# EAGLE design shield confortimetro 1.1 (EAGLE 7.2.0)
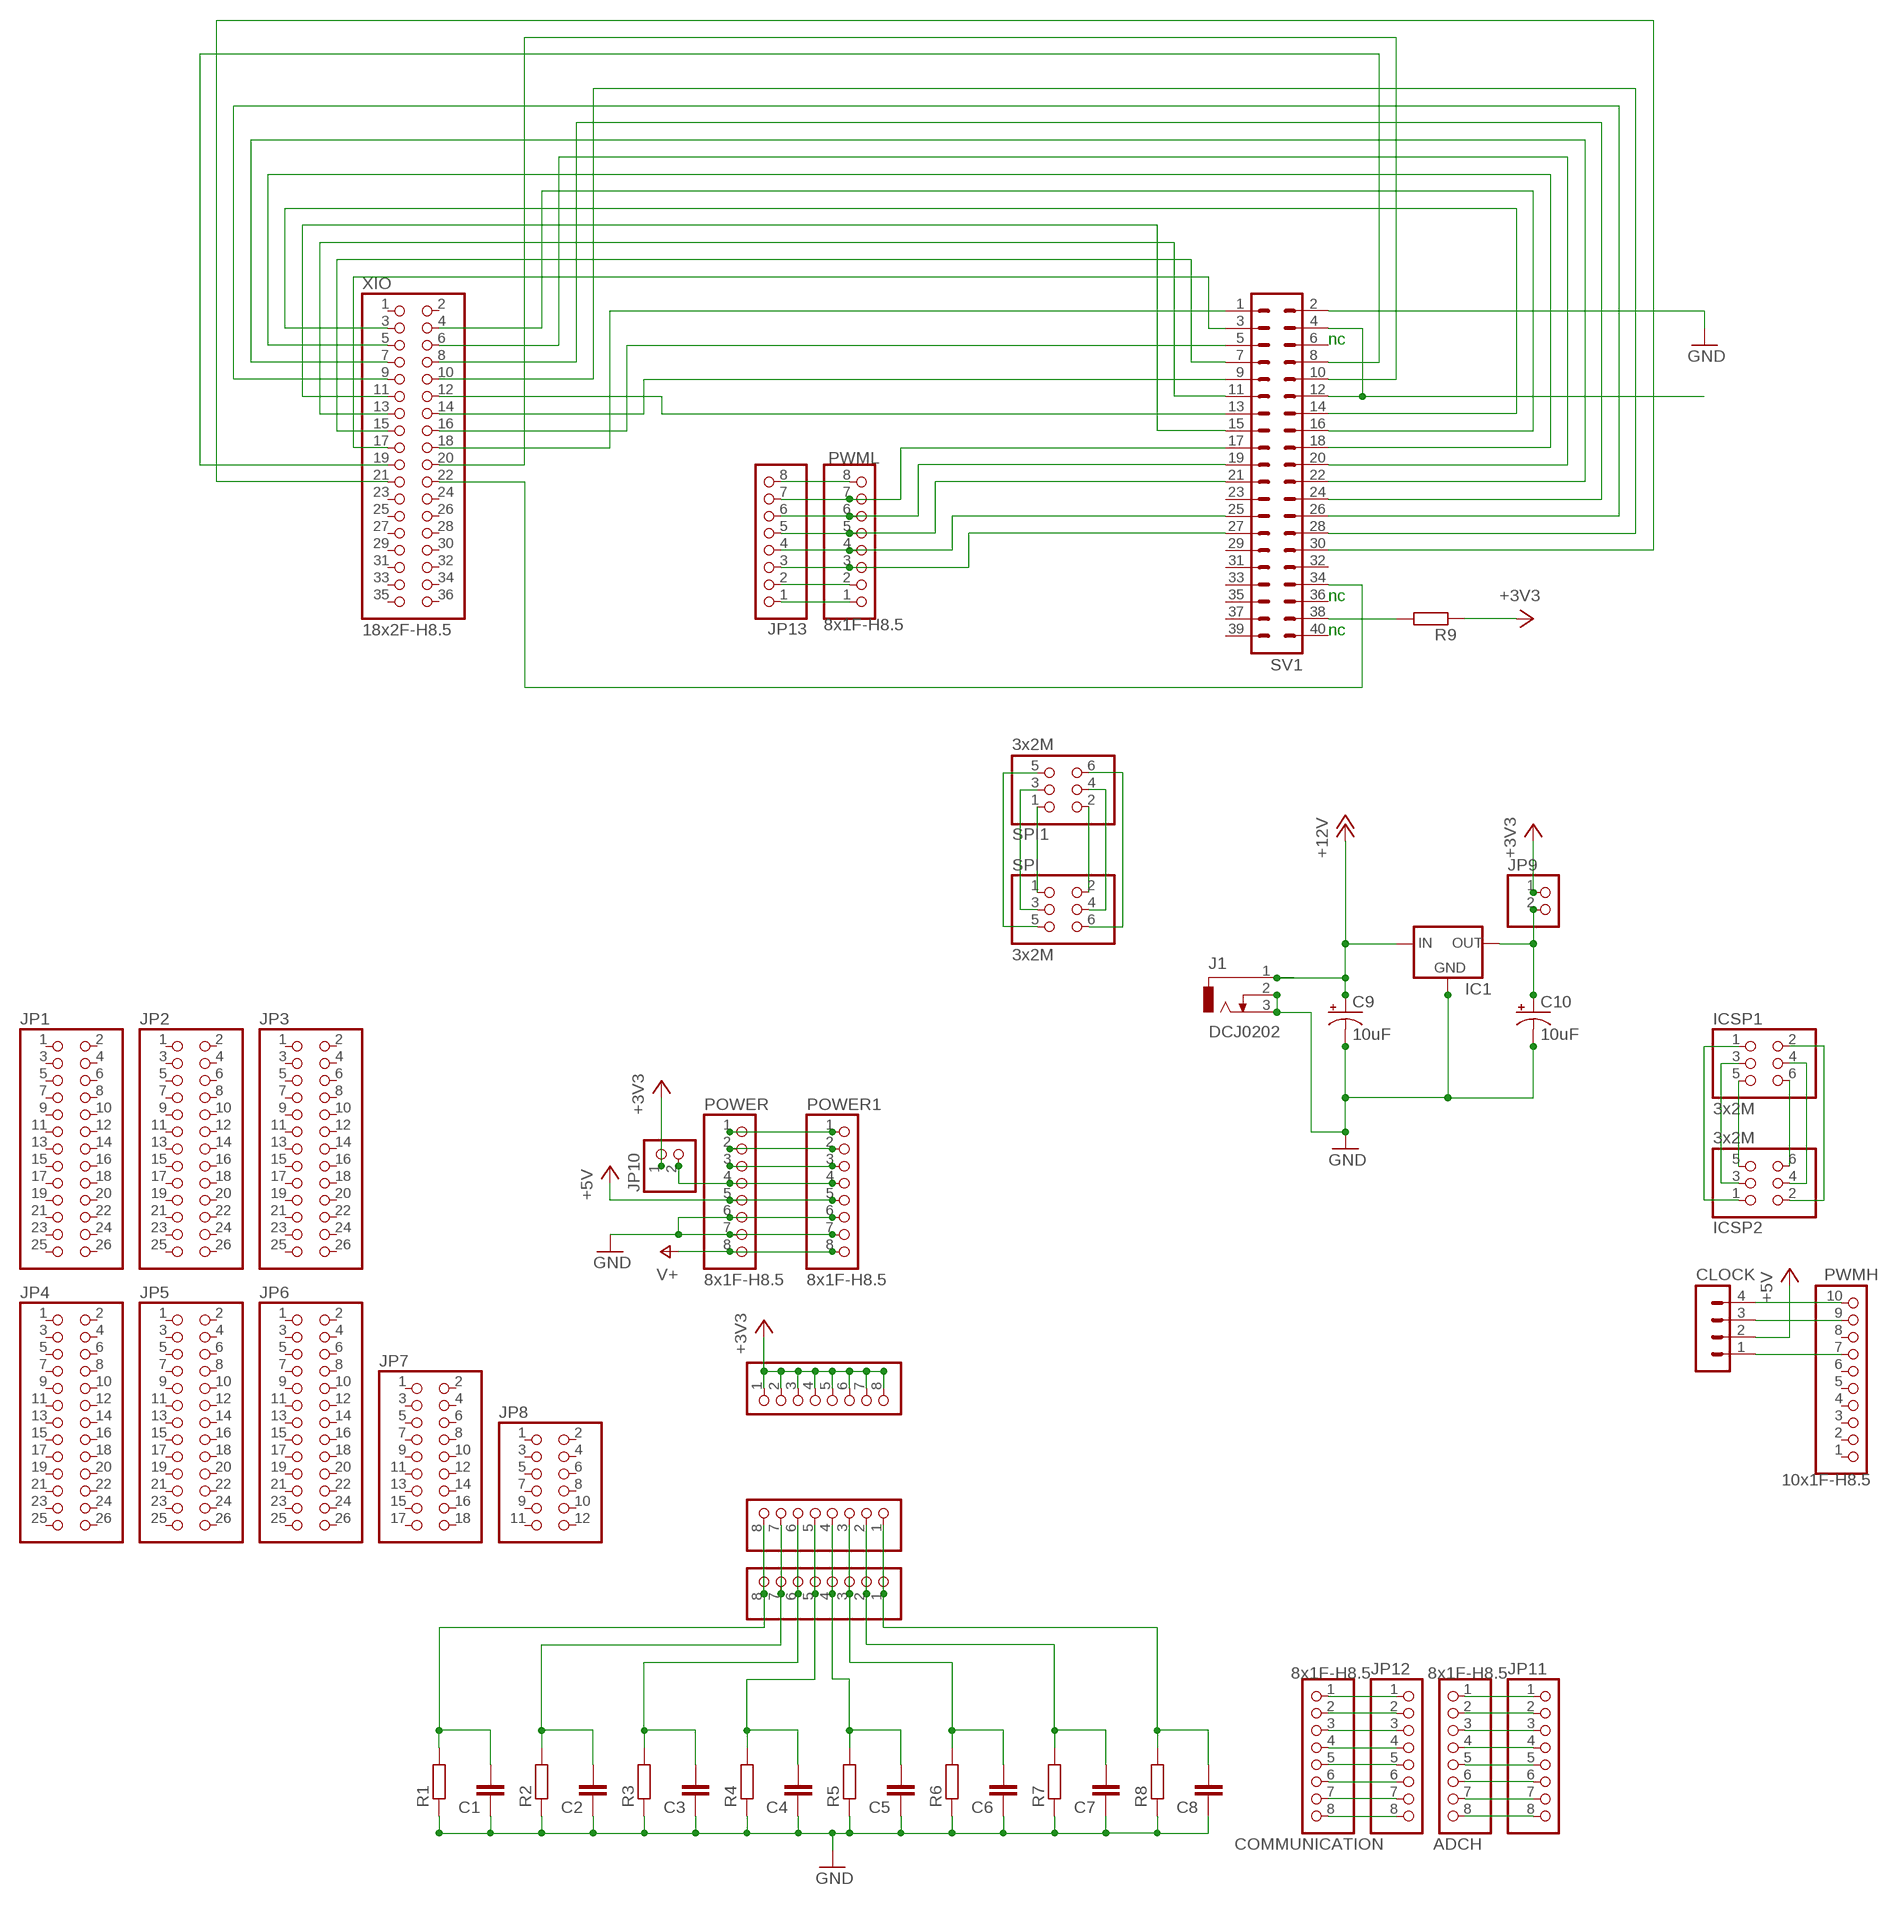
[diagram p0: schematic, sheet 1]

## Parts
ADCH  8x1F-H8.5  PINHD-1X8  [1X08]
ADCL  8x1F-H8.5  PINHD-1X8  [1X08]
C1  C5/2.5  [C5B2.5]
C2  C5/2.5  [C5B2.5]
C3  C5/2.5  [C5B2.5]
C4  C5/2.5  [C5B2.5]
C5  C5/2.5  [C5B2.5]
C6  C5/2.5  [C5B2.5]
C7  C5/2.5  [C5B2.5]
C8  C5/2.5  [C5B2.5]
C9  10uF  CPOL-USE2-5  [E2-5]
C10  10uF  CPOL-USE2-5  [E2-5]
CLOCK  MA04-1  [MA04-1]
COMMUNICATION  8x1F-H8.5  PINHD-1X8  [1X08]
IC1  78XXL  [78XXL]
ICSP1  3x2M  PINHD-2X3  [2X03]
ICSP2  3x2M  PINHD-2X3  [2X03]
J1  DCJ0202  [DCJ0202]
JP1  PINHD-2X13  [2X13]
JP2  PINHD-2X13  [2X13]
JP3  PINHD-2X13  [2X13]
JP4  PINHD-2X13  [2X13]
JP5  PINHD-2X13  [2X13]
JP6  PINHD-2X13  [2X13]
JP7  PINHD-2X9  [2X09]
JP8  PINHD-2X6  [2X06]
JP9  PINHD-1X2  [1X02]
JP10  PINHD-1X2  [1X02]
JP11  PINHD-1X8  [1X08]
JP12  PINHD-1X8  [1X08]
JP13  PINHD-1X8  [1X08]
POWER  8x1F-H8.5  PINHD-1X8  [1X08]
POWER1  8x1F-H8.5  PINHD-1X8  [1X08]
PWMH  10x1F-H8.5  PINHD-1X10  [1X10]
PWML  8x1F-H8.5  PINHD-1X8  [1X08]
PWML1  8x1F-H8.5  PINHD-1X8  [1X08]
PWML2  8x1F-H8.5  PINHD-1X8  [1X08]
R1  R-EU_0204/7  [0204/7]
R2  R-EU_0204/7  [0204/7]
R3  R-EU_0204/7  [0204/7]
R4  R-EU_0204/7  [0204/7]
R5  R-EU_0204/7  [0204/7]
R6  R-EU_0204/7  [0204/7]
R7  R-EU_0204/7  [0204/7]
R8  R-EU_0204/7  [0204/7]
R9  R-EU_0204/7  [0204/7]
SPI  3x2M  PINHD-2X3  [2X03]
SPI1  3x2M  PINHD-2X3  [2X03]
SV1  ML40  [ML40]
XIO  18x2F-H8.5  PINHD-2X18  [2X18]

## Nets
+3V3: JP9.1 JP10.1 PWML2.1 PWML2.2 PWML2.3 PWML2.4 PWML2.5 PWML2.6 PWML2.7 PWML2.8 R9.1
+5V: CLOCK.2 POWER1.5 POWER.5
+12V: C9.+ IC1.IN J1.1
GND: C1.1 C2.1 C3.1 C4.1 C5.1 C6.1 C7.1 C8.1 C9.- C10.- IC1.GND J1.2 J1.3 POWER1.6 POWER1.7 POWER.6 POWER.7 R1.1 R2.1 R3.1 R4.1 R5.1 R6.1 R7.1 R8.1 SV1.2
N$1: ADCL.2 C7.2 PWML1.2 R7.2
N$2: ADCL.8 C1.2 PWML1.8 R1.2
N$3: ADCL.7 C2.2 PWML1.7 R2.2
N$4: ADCL.6 C3.2 PWML1.6 R3.2
N$5: ADCL.5 C4.2 PWML1.5 R4.2
N$6: ADCL.4 C5.2 PWML1.4 R5.2
N$7: POWER1.1 POWER.1
N$8: POWER1.2 POWER.2
N$9: POWER1.3 POWER.3
N$10: ADCL.3 C6.2 PWML1.3 R6.2
N$11: ADCL.1 C8.2 PWML1.1 R8.2
N$12: ICSP1.5 ICSP2.5
N$13: ICSP1.6 ICSP2.6
N$14: ICSP1.3 ICSP2.3
N$15: ICSP1.1 ICSP2.1
N$16: ICSP1.4 ICSP2.4
N$17: ICSP1.2 ICSP2.2
N$18: SPI1.1 SPI.1
N$19: SPI1.2 SPI.2
N$20: SPI1.3 SPI.3
N$21: SPI1.4 SPI.4
N$22: SPI1.6 SPI.6
N$23: SPI1.5 SPI.5
N$24: SV1.1 XIO.18
N$25: CLOCK.4 PWMH.10
N$26: CLOCK.3 PWMH.9
N$27: CLOCK.1 PWMH.7
N$29: ADCH.1 JP11.1
N$30: ADCH.8 JP11.8
N$31: ADCH.7 JP11.7
N$32: ADCH.6 JP11.6
N$33: ADCH.5 JP11.5
N$34: ADCH.4 JP11.4
N$35: ADCH.3 JP11.3
N$36: ADCH.2 JP11.2
N$37: COMMUNICATION.8 JP12.8
N$38: COMMUNICATION.7 JP12.7
N$39: COMMUNICATION.6 JP12.6
N$40: COMMUNICATION.5 JP12.5
N$41: COMMUNICATION.4 JP12.4
N$42: COMMUNICATION.3 JP12.3
N$43: COMMUNICATION.2 JP12.2
N$44: COMMUNICATION.1 JP12.1
N$45: JP13.8 PWML.8
N$46: JP13.7 PWML.7 SV1.17
N$47: JP13.6 PWML.6 SV1.19
N$48: JP13.5 PWML.5 SV1.21
N$49: JP13.4 PWML.4 SV1.25
N$50: JP13.3 PWML.3 SV1.27
N$51: JP13.2 PWML.2
N$52: JP13.1 PWML.1
N$53: SV1.3 XIO.17
N$54: SV1.5 XIO.16
N$55: SV1.7 XIO.15
N$56: SV1.9 XIO.14
N$57: SV1.11 XIO.13
N$58: SV1.13 XIO.12
N$59: SV1.15 XIO.11
N$60: SV1.14 XIO.3
N$61: SV1.16 XIO.4
N$62: SV1.18 XIO.5
N$63: SV1.20 XIO.6
N$64: SV1.22 XIO.7
N$65: SV1.24 XIO.8
N$66: SV1.26 XIO.9
N$67: SV1.28 XIO.10
N$68: SV1.30 XIO.21
N$69: SV1.4 SV1.12
N$70: SV1.10 XIO.20
N$71: SV1.8 XIO.19
N$72: SV1.34 XIO.22
N$73: R9.2 SV1.38
N$74: C10.+ IC1.OUT JP9.2
N$75: JP10.2 POWER1.4 POWER.4
V+: POWER1.8 POWER.8
Unconnected: JP1.1 JP1.2 JP1.3 JP1.4 JP1.5 JP1.6 JP1.7 JP1.8 JP1.9 JP1.10 JP1.11 JP1.12 JP1.13 JP1.14 JP1.15 JP1.16 JP1.17 JP1.18 JP1.19 JP1.20 JP1.21 JP1.22 JP1.23 JP1.24 JP1.25 JP1.26 JP2.1 JP2.2 JP2.3 JP2.4 JP2.5 JP2.6 JP2.7 JP2.8 JP2.9 JP2.10 JP2.11 JP2.12 JP2.13 JP2.14 JP2.15 JP2.16 JP2.17 JP2.18 JP2.19 JP2.20 JP2.21 JP2.22 JP2.23 JP2.24 JP2.25 JP2.26 JP3.1 JP3.2 JP3.3 JP3.4 JP3.5 JP3.6 JP3.7 JP3.8 JP3.9 JP3.10 JP3.11 JP3.12 JP3.13 JP3.14 JP3.15 JP3.16 JP3.17 JP3.18 JP3.19 JP3.20 JP3.21 JP3.22 JP3.23 JP3.24 JP3.25 JP3.26 JP4.1 JP4.2 JP4.3 JP4.4 JP4.5 JP4.6 JP4.7 JP4.8 JP4.9 JP4.10 JP4.11 JP4.12 JP4.13 JP4.14 JP4.15 JP4.16 JP4.17 JP4.18 JP4.19 JP4.20 JP4.21 JP4.22 JP4.23 JP4.24 JP4.25 JP4.26 JP5.1 JP5.2 JP5.3 JP5.4 JP5.5 JP5.6 JP5.7 JP5.8 JP5.9 JP5.10 JP5.11 JP5.12 JP5.13 JP5.14 JP5.15 JP5.16 JP5.17 JP5.18 JP5.19 JP5.20 JP5.21 JP5.22 JP5.23 JP5.24 JP5.25 JP5.26 JP6.1 JP6.2 JP6.3 JP6.4 JP6.5 JP6.6 JP6.7 JP6.8 JP6.9 JP6.10 JP6.11 JP6.12 JP6.13 JP6.14 JP6.15 JP6.16 JP6.17 JP6.18 JP6.19 JP6.20 JP6.21 JP6.22 JP6.23 JP6.24 JP6.25 JP6.26 JP7.1 JP7.2 JP7.3 JP7.4 JP7.5 JP7.6 JP7.7 JP7.8 JP7.9 JP7.10 JP7.11 JP7.12 JP7.13 JP7.14 JP7.15 JP7.16 JP7.17 JP7.18 JP8.1 JP8.2 JP8.3 JP8.4 JP8.5 JP8.6 JP8.7 JP8.8 JP8.9 JP8.10 JP8.11 JP8.12 PWMH.1 PWMH.2 PWMH.3 PWMH.4 PWMH.5 PWMH.6 PWMH.8 SV1.6 SV1.23 SV1.29 SV1.31 SV1.32 SV1.33 SV1.35 SV1.36 SV1.37 SV1.39 SV1.40 XIO.1 XIO.2 XIO.23 XIO.24 XIO.25 XIO.26 XIO.27 XIO.28 XIO.29 XIO.30 XIO.31 XIO.32 XIO.33 XIO.34 XIO.35 XIO.36

## Notes on the sheet
- nc
- nc
- nc

## Library data of the parts
ADCH ADCL COMMUNICATION POWER POWER1 PWML PWML1 PWML2 = SmartPrj:PINHD-1X8: PIN HEADER
C1-C8 = capacitor-wima:C: CAPACITOR naming: grid - package width
C9 C10 = rcl:CPOL-US: POLARIZED CAPACITOR, American symbol
CLOCK = con-lstb:MA04-1: PIN HEADER; OC_FARNELL: unknown; OC_NEWARK: unknown
IC1 = v-reg:78XXL: VOLTAGE REGULATOR
ICSP1 ICSP2 SPI SPI1 = SmartPrj:PINHD-2X3: PIN HEADER
J1 = con-jack:DCJ0202: DC POWER JACK Source: DCJ0202.pdf; OC_FARNELL: unknown; OC_NEWARK: unknown
JP1-JP6 = pinhead:PINHD-2X13: PIN HEADER
JP7 = pinhead:PINHD-2X9: PIN HEADER
JP8 = pinhead:PINHD-2X6: PIN HEADER
JP9 JP10 = pinhead:PINHD-1X2: PIN HEADER
JP11-JP13 = pinhead:PINHD-1X8: PIN HEADER
PWMH = SmartPrj:PINHD-1X10: PIN HEADER
R1-R9 = rcl:R-EU_: RESISTOR, European symbol
SV1 = con-harting-ml:ML40: HARTING; OC_FARNELL: unknown; OC_NEWARK: unknown
XIO = SmartPrj:PINHD-2X18: PIN HEADER

## Net classes
0 default: width 0.203 mm, drill 0.406 mm, clearance 0.203 mm
1 USB: width 0.203 mm, drill 0.406 mm, clearance 0.203 mm
2 gnd: width 0.203 mm, drill 0.406 mm, clearance 0.203 mm
3 usbvcc: width 0.203 mm, drill 0.406 mm, clearance 0.203 mm
4 USBpair: width 0.254 mm, drill 0.406 mm, clearance 0.61 mm

## Board
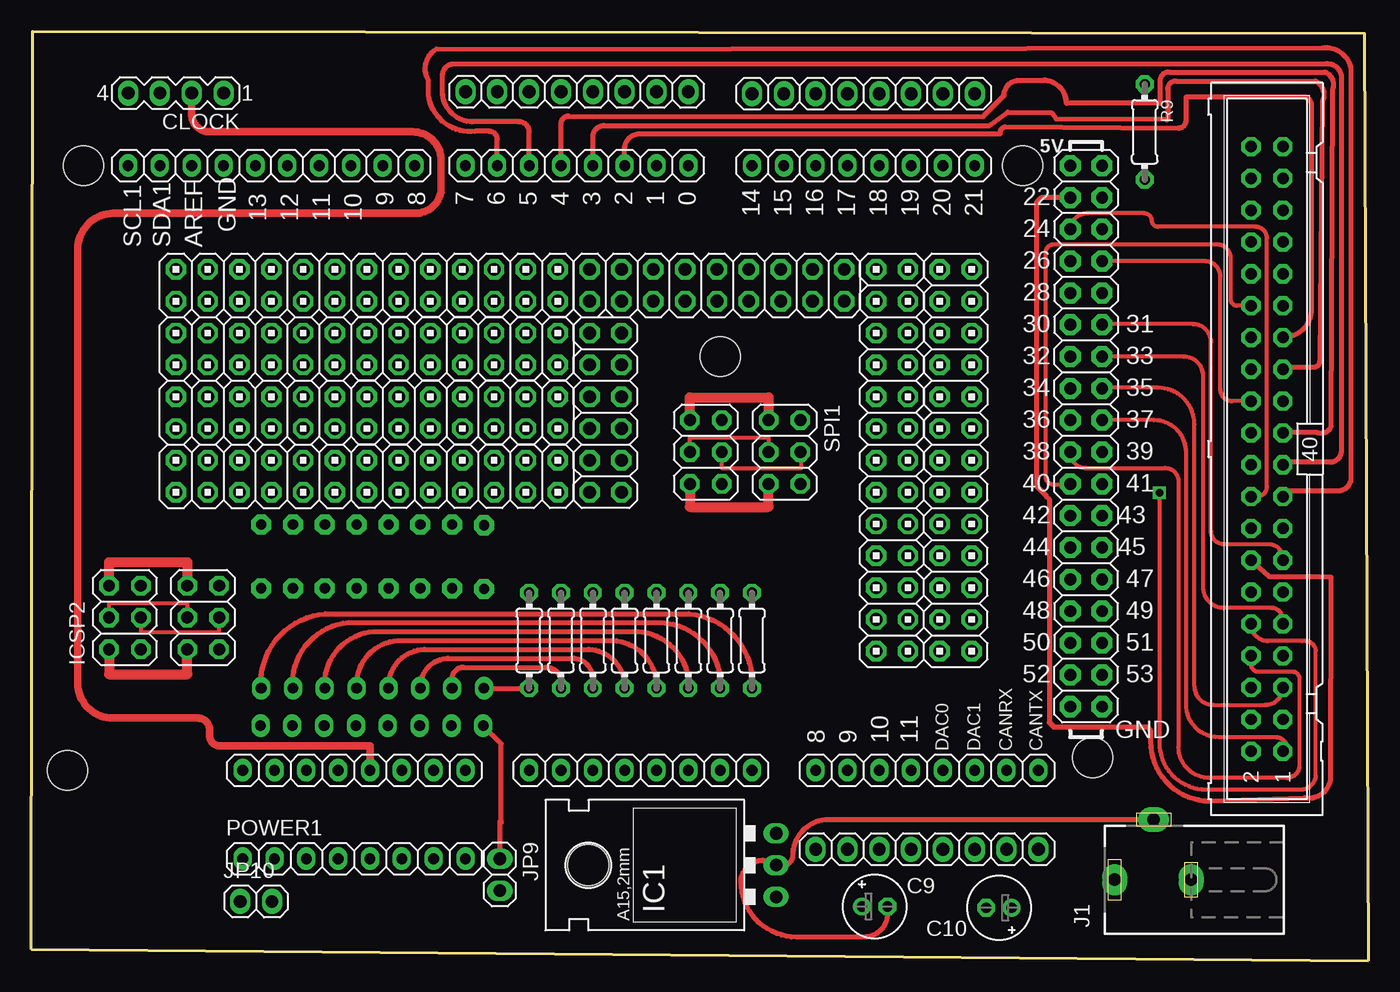
[diagram p1: board, top side]
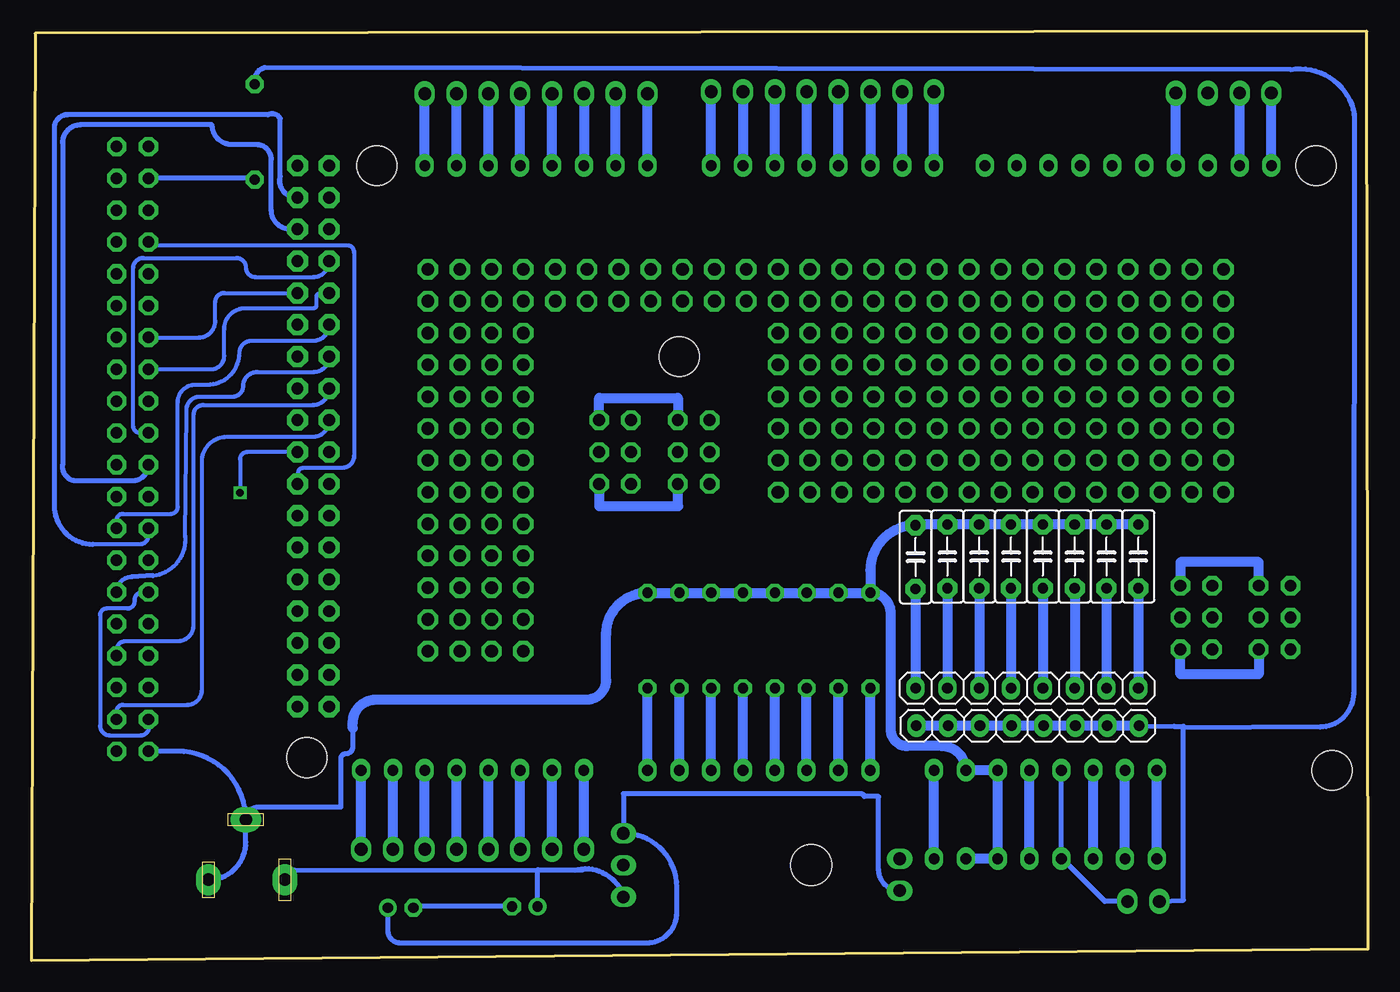
[diagram p2: board, bottom side, seen from below]

Size 106.68 x 74.17 mm. Coordinates in mm from the lower left corner, seen from the top.
Outline: 0,0.91 106.68,0 106.38,74.02 0.1,74.17 0,0.91
Copper layers (1*16): Top 0.035mm / dielectric 1.6mm / Bottom 0.035mm
Design rules "default *": minimum track width 8mil, minimum drill 16mil, track to track 8mil, track to pad 8mil, pad to pad 8mil, via to via 8mil, smd to smd 6mil, copper to edge 20mil, drill to drill 12mil, minimum pad ring 12mil, minimum via ring 8mil, stop-mask expansion 2mil, vias tented up to drill 25mil, thermal gap 8mil
Holes 3.2 mm at 84.68,16.21 4.17,63.45 79.1,63.45 2.9,15.19 54.97,48.21
tRestrict: area 1.6,60.9 to 6.7,66; area 52.4,45.7 to 57.5,50.7; area 76.6,60.9 to 81.6,66; area 82.9,12.6 to 88,17.7; area 0.4,12.6 to 5.4,17.7; 5 lines
bRestrict: area 1.6,60.9 to 6.7,66; area 52.4,45.7 to 57.5,50.7; area 76.6,60.9 to 81.6,66; area 82.9,12.6 to 88,17.7; area 0.4,12.6 to 5.4,17.7; 5 lines

### Footprints (pad centres in the part's own frame; a part is rotated, then mirrored left to right if it is on the bottom)
1X08 = drill 0.85 pad 1.422 long: 1 -8.89,0; 2 -6.35,0; 3 -3.81,0; 4 -1.27,0; 5 1.27,0; 6 3.81,0; 7 6.35,0; 8 8.89,0
C5B2.5 = drill 0.813 pad 1.6 octagon: 1 -2.54,0; 2 2.54,0
E2-5 = drill 0.813 pad 1.27: + -1.016,0 | drill 0.813 pad 1.27 octagon: - 1.016,0
MA04-1 = drill 1.016 long: 1 -3.81,0; 2 -1.27,0; 3 1.27,0; 4 3.81,0
78XXL = drill 1.016 long: GND 0,-3.81; IN -2.54,-3.81; OUT 2.54,-3.81 | hole 3.302: 0,11.176
2X03 = drill 0.95 pad 1.55 octagon: 1 -2.54,-1.27; 2 -2.54,1.27; 3 0,-1.27; 4 0,1.27; 5 2.54,-1.27; 6 2.54,1.27
DCJ0202 = drill 1 pad 2 long: 1 0,3.1; 2 4.8,0; 3 0,-3
2X13 = drill 1.016 octagon: 1 -15.24,-1.27; 2 -15.24,1.27; 3 -12.7,-1.27; 4 -12.7,1.27; 5 -10.16,-1.27; 6 -10.16,1.27; 7 -7.62,-1.27; 8 -7.62,1.27; 9 -5.08,-1.27; 10 -5.08,1.27; 11 -2.54,-1.27; 12 -2.54,1.27; 13 0,-1.27; 14 0,1.27; 15 2.54,-1.27; 16 2.54,1.27; 17 5.08,-1.27; 18 5.08,1.27; 19 7.62,-1.27; 20 7.62,1.27; 21 10.16,-1.27; 22 10.16,1.27; 23 12.7,-1.27; 24 12.7,1.27; 25 15.24,-1.27; 26 15.24,1.27
2X09 = drill 1.016 octagon: 1 -10.16,-1.27; 2 -10.16,1.27; 3 -7.62,-1.27; 4 -7.62,1.27; 5 -5.08,-1.27; 6 -5.08,1.27; 7 -2.54,-1.27; 8 -2.54,1.27; 9 0,-1.27; 10 0,1.27; 11 2.54,-1.27; 12 2.54,1.27; 13 5.08,-1.27; 14 5.08,1.27; 15 7.62,-1.27; 16 7.62,1.27; 17 10.16,-1.27; 18 10.16,1.27
2X06 = drill 1.016 octagon: 1 -6.35,-1.27; 2 -6.35,1.27; 3 -3.81,-1.27; 4 -3.81,1.27; 5 -1.27,-1.27; 6 -1.27,1.27; 7 1.27,-1.27; 8 1.27,1.27; 9 3.81,-1.27; 10 3.81,1.27; 11 6.35,-1.27; 12 6.35,1.27
1X02 = drill 1.016 long: 1 -1.27,0; 2 1.27,0
1X08' = drill 1.016 long: 1 -8.89,0; 2 -6.35,0; 3 -3.81,0; 4 -1.27,0; 5 1.27,0; 6 3.81,0; 7 6.35,0; 8 8.89,0
1X10 = drill 0.85 pad 1.422 long: 1 -11.43,0; 2 -8.89,0; 3 -6.35,0; 4 -3.81,0; 5 -1.27,0; 6 1.27,0; 7 3.81,0; 8 6.35,0; 9 8.89,0; 10 11.43,0
0204/7 = drill 0.813 octagon: 1 -3.81,0; 2 3.81,0
ML40 = drill 0.914 octagon: 1 -24.13,-1.27; 2 -24.13,1.27; 3 -21.59,-1.27; 4 -21.59,1.27; 5 -19.05,-1.27; 6 -19.05,1.27; 7 -16.51,-1.27; 8 -16.51,1.27; 9 -13.97,-1.27; 10 -13.97,1.27; 11 -11.43,-1.27; 12 -11.43,1.27; 13 -8.89,-1.27; 14 -8.89,1.27; 15 -6.35,-1.27; 16 -6.35,1.27; 17 -3.81,-1.27; 18 -3.81,1.27; 19 -1.27,-1.27; 20 -1.27,1.27; 21 1.27,-1.27; 22 1.27,1.27; 23 3.81,-1.27; 24 3.81,1.27; 25 6.35,-1.27; 26 6.35,1.27; 27 8.89,-1.27; 28 8.89,1.27; 29 11.43,-1.27; 30 11.43,1.27; 31 13.97,-1.27; 32 13.97,1.27; 33 16.51,-1.27; 34 16.51,1.27; 35 19.05,-1.27; 36 19.05,1.27; 37 21.59,-1.27; 38 21.59,1.27; 39 24.13,-1.27; 40 24.13,1.27
2X18 = drill 0.95 pad 1.676 octagon: 1 -21.59,-1.27; 2 -21.59,1.27; 3 -19.05,-1.27; 4 -19.05,1.27; 5 -16.51,-1.27; 6 -16.51,1.27; 7 -13.97,-1.27; 8 -13.97,1.27; 9 -11.43,-1.27; 10 -11.43,1.27; 11 -8.89,-1.27; 12 -8.89,1.27; 13 -6.35,-1.27; 14 -6.35,1.27; 15 -3.81,-1.27; 16 -3.81,1.27; 17 -1.27,-1.27; 18 -1.27,1.27; 19 1.27,-1.27; 20 1.27,1.27; 21 3.81,-1.27; 22 3.81,1.27; 23 6.35,-1.27; 24 6.35,1.27; 25 8.89,-1.27; 26 8.89,1.27; 27 11.43,-1.27; 28 11.43,1.27; 29 13.97,-1.27; 30 13.97,1.27; 31 16.51,-1.27; 32 16.51,1.27; 33 19.05,-1.27; 34 19.05,1.27; 35 21.59,-1.27; 36 21.59,1.27

### Placement (x,y rotation side)
ADCH  71.48,15.19 0 top
ADCL  48.62,15.19 0 top
C1  18.34,32.26 270 bottom
C2  20.88,32.26 270 bottom
C3  23.42,32.26 270 bottom
C4  25.96,32.26 270 bottom
C5  28.5,32.26 270 bottom
C6  31.04,32.26 270 bottom
C7  33.58,32.26 270 bottom
C8  36.12,32.21 270 bottom
C9  67.31,4.32 0 top
C10  77.22,4.22 180 top
CLOCK  11.53,69.24 180 top
COMMUNICATION  66.4,63.45 0 top
IC1  55.63,7.62 90 top
ICSP1  13.71,27.38 90 top
ICSP2  7.47,27.38 90 top
J1  89.56,6.45 90 top
JP1  26.77,53.9 0 top
JP2  26.77,48.82 0 top
JP3  26.77,43.74 0 top
JP4  26.77,38.66 0 top
JP5  68.68,39.93 90 top
JP6  73.76,39.93 90 top
JP7  54.71,53.9 0 top
JP8  45.82,43.74 90 top
JP9  37.39,6.86 270 top
JP10  17.93,4.72 0 top
JP11  [1X08']  71.48,8.89 0 top
JP12  [1X08']  66.4,69.19 0 top
JP13  [1X08']  43.54,69.34 180 top
POWER  25.76,15.19 0 top
POWER1  25.76,8.13 0 top
PWMH  19.15,63.45 180 top
PWML  43.54,63.45 180 top
PWML1  27.23,21.74 0 bottom
PWML2  27.18,18.75 0 bottom
R1  57.51,25.55 270 top
R2  54.97,25.55 270 top
R3  52.43,25.55 270 top
R4  49.89,25.55 270 top
R5  47.35,25.55 270 top
R6  44.81,25.55 270 top
R7  42.27,25.55 270 top
R8  39.73,25.55 270 top
R9  88.85,66.14 270 top
SPI  53.82,40.59 270 top
SPI1  60.1,40.59 270 top
SV1  98.6,40.84 90 top
XIO  84.18,41.86 270 top

### Tracks (layer width: path | path; a pad name or v marks a point on that pad's centre or on a via)
+3V3
  Top 0.406: PWML2.1 37.49,17.32 37.49,11.13 | 37.49,11.02 37.49,11.13 | JP9.1 37.39,11.02 arc-90 37.49,11.13
  Bottom 0.406: PWML2.8 15.49,18.69 14.73,18.69 14.73,18.59 | JP10.1 14.73,4.83 14.73,18.59 | 14.73,18.59 3.86,18.64 arc-90 1.17,21.34 1.12,67.51 arc-90 6.2,71.12 88.04,71.27 arc-90 R9.1
  Bottom 0.813: PWML2.8 PWML2.7 PWML2.6 PWML2.5 PWML2.4 PWML2.3 PWML2.2 PWML2.1
+5V
  Top 0.61: CLOCK.2 12.8,67.56 arc90 14.22,66.14 30.43,66.14 arc-90 32.72,63.86 32.72,61.72 arc-90 30.63,59.64 6.55,59.64 arc90 3.71,56.79 3.71,22.15 arc90 6.5,19.36 13.31,19.36 arc-90 14.22,18.44 14.22,17.98 arc90 15.09,17.12 27.03,17.12 POWER.5
  Bottom 0.813: POWER1.5 POWER.5
+12V
  Bottom 0.406: J1.1 arc90 85.7,7.21 66.24,7.26 | 66.24,7.26 62.64,7.26 63.35,7.21 arc90 IC1.IN 59.54,5.08 | C9.+ 66.29,7.21 arc90 66.24,7.26
GND
  Top 0.406: J1.2 63.63,11.25 arc90 60.76,8.38 arc-90 59.99,7.62 IC1.GND arc129 56.64,6.3 arc90 61.06,1.88 66.45,1.88 arc90 68.33,3.76 C9.-
  Bottom 0.406: 97.38,16.66 arc90 SV1.2 95.02,16.71 arc90 J1.2 | J1.3 arc-90 89.56,9.45 J1.2 | C9.- 76.1,4.32 arc-90 C10.- | 81.03,18.54 81.03,17.07 arc90 81.58,16.51 arc-90 81.99,16.1 81.99,12.24 88.57,12.24 arc-90 J1.2
  Bottom 0.813: R8.1 R7.1 R6.1 R5.1 R4.1 R3.1 R2.1 R1.1 arc-90 60.81,26.06 60.81,22.4 arc90 62.38,20.83 79.2,20.83 arc-90 81.03,19 81.03,18.54 | C1.1 C2.1 C3.1 C4.1 C5.1 C6.1 C7.1 36.07,34.8 arc-90 C8.1 arc-90 39.73,31.14 R8.1 | R8.1 arc90 38.1,27.74 38.1,18.44 arc-90 36.78,17.12 34.04,17.12 arc90 POWER.7 POWER.6 POWER1.6 POWER1.7
N$1
  Top 0.406: PWML1.2 33.58,22.5 arc-90 34.49,23.42 41.05,23.42 arc-90 42.27,22.3 R7.2
  Bottom 0.813: ADCL.2 R7.2 | C7.2 PWML1.2
N$2
  Top 0.406: PWML1.8 arc-90 23.47,27.69 52.48,27.69 arc-90 R1.2
  Bottom 0.813: ADCL.8 R1.2 | C1.2 PWML1.8
N$3
  Top 0.406: PWML1.7 arc-90 25.3,26.98 50.34,26.98 arc-90 R2.2
  Bottom 0.813: ADCL.7 R2.2 | C2.2 PWML1.7
N$4
  Top 0.406: PWML1.6 arc-90 27.33,26.26 48.41,26.26 arc-90 R3.2
  Bottom 0.813: ADCL.6 R3.2 | C3.2 PWML1.6
N$5
  Top 0.406: PWML1.5 arc-90 29.26,25.55 46.38,25.55 arc-90 R4.2
  Bottom 0.813: ADCL.5 R4.2 | C4.2 PWML1.5
N$6
  Top 0.406: PWML1.4 arc-90 31.34,24.84 44.5,24.84 arc-90 R5.2
  Bottom 0.813: ADCL.4 R5.2 | C5.2 PWML1.4
N$7
  Bottom 0.813: POWER1.1 POWER.1
N$8
  Bottom 0.813: POWER1.2 POWER.2
N$9
  Bottom 0.813: POWER1.3 POWER.3
N$10
  Top 0.406: PWML1.3 arc-90 33.22,24.13 43.18,24.13 arc-90 44.81,22.5 R6.2
  Bottom 0.813: ADCL.3 R6.2 | C6.2 PWML1.3
N$11
  Top 0.406: PWML1.1 R8.2
  Bottom 0.813: ADCL.1 R8.2 | C8.2 PWML1.1
N$12
  Bottom 0.813: ICSP2.5 8.74,31.8 14.99,31.8 ICSP1.5
N$13
  Top 0.813: ICSP2.6 6.2,31.8 12.45,31.8 ICSP1.6
N$14
  Top 0.305: ICSP2.3 8.74,26.21 14.99,26.21 ICSP1.3
N$15
  Bottom 0.813: ICSP2.1 8.74,22.86 14.99,22.86 ICSP1.1
N$16
  Top 0.305: ICSP2.4 6.2,28.55 12.45,28.55 ICSP1.4
N$17
  Top 0.813: ICSP2.2 6.2,22.86 12.44,22.86 ICSP1.2
N$18
  Top 0.813: SPI.1 52.55,44.96 58.83,44.96 SPI1.1
N$19
  Bottom 0.813: SPI1.2 61.37,44.91 55.09,44.91 SPI.2
N$20
  Top 0.305: SPI.3 52.55,41.76 58.83,41.76 SPI1.3
N$21
  Top 0.305: SPI.4 55.09,39.32 61.47,39.32 61.47,40.59 SPI1.4
N$22
  Bottom 0.813: SPI1.6 61.37,36.27 55.07,36.27 55.07,38.05 SPI.6
N$23
  Top 0.813: SPI.5 52.55,36.22 58.83,36.22 SPI1.5
N$24
  Top 0.305: SV1.1 100.28,16.82 arc90 99.26,17.83 94.74,17.83 arc-90 92.15,20.42 92.15,40.59 arc90 89.61,43.13 XIO.18
N$25
  Bottom 0.813: PWMH.10 CLOCK.4
N$26
  Bottom 0.813: PWMH.9 CLOCK.3
N$27
  Bottom 0.813: PWMH.7 CLOCK.1
N$29
  Bottom 0.813: JP11.1 ADCH.1
N$30
  Bottom 0.813: JP11.8 ADCH.8
N$31
  Bottom 0.813: JP11.7 ADCH.7
N$32
  Bottom 0.813: JP11.6 ADCH.6
N$33
  Bottom 0.813: JP11.5 ADCH.5
N$34
  Bottom 0.813: JP11.4 ADCH.4
N$35
  Bottom 0.813: JP11.3 ADCH.3
N$36
  Bottom 0.813: JP11.2 ADCH.2
N$37
  Bottom 0.813: COMMUNICATION.8 JP12.8
N$38
  Bottom 0.813: COMMUNICATION.7 JP12.7
N$39
  Bottom 0.813: COMMUNICATION.6 JP12.6
N$40
  Bottom 0.813: COMMUNICATION.5 JP12.5
N$41
  Bottom 0.813: COMMUNICATION.4 JP12.4
N$42
  Bottom 0.813: JP12.3 COMMUNICATION.3
N$43
  Bottom 0.813: COMMUNICATION.2 JP12.2
N$44
  Bottom 0.813: COMMUNICATION.1 JP12.1
N$45
  Bottom 0.813: PWML.8 JP13.8
N$46
  Top 0.406: PWML.7 37.19,65.53 arc90 36.53,66.19 35.41,66.19 arc-90 31.7,69.09 31.7,70.26 arc-90 32.31,72.75 103.02,72.85 arc-90 105.31,71.12 105.31,38.46 arc-90 104.19,37.49 100.33,37.49 arc90 SV1.17
  Bottom 0.813: PWML.7 JP13.7
N$47
  Top 0.406: PWML.6 39.73,66.14 arc90 38.91,66.95 35.2,66.95 arc-90 32.82,69.34 32.82,70.66 arc-90 33.73,71.58 103.28,71.58 arc-90 104.55,70.56 104.55,40.69 arc-90 103.63,39.78 100.08,39.78 arc90 SV1.19
  Bottom 0.813: JP13.6 PWML.6
N$48
  Top 0.406: PWML.5 42.27,66.8 arc-90 42.88,67.41 75.95,67.36 77.62,69.04 arc-90 78.84,70.26 80.77,70.26 arc-90 82.6,68.43 90.07,68.43 90.07,70.21 arc-90 90.78,70.92 103.23,70.92 arc-90 103.84,69.49 103.68,42.57 arc-90 102.57,42.16 99.92,42.16 arc90 SV1.21
  Bottom 0.813: PWML.5 JP13.5
N$49
  Top 0.406: PWML.4 44.81,65.74 arc-90 45.72,66.65 76.45,66.65 77.93,67.72 81.43,67.67 81.79,67.16 90.58,67.11 arc90 90.68,67.21 90.68,69.55 arc-90 91.34,70.21 102.46,70.21 arc-90 103.02,68.58 102.82,47.85 arc-90 102.31,47.35 100.03,47.35 arc90 SV1.25
  Bottom 0.813: JP13.4 PWML.4
N$50
  Top 0.406: PWML.3 47.35,64.82 arc-90 48.56,65.99 77.32,65.99 arc-90 77.72,66.55 91.54,66.45 arc90 92.15,67.06 92.15,68.94 101.5,68.94 arc-90 102.16,68.28 102.16,52.02 arc-90 SV1.27
  Bottom 0.813: PWML.3 JP13.3
N$51
  Bottom 0.813: JP13.2 PWML.2
N$52
  Bottom 0.813: PWML.1 JP13.1
N$53
  Bottom 0.305: SV1.3 99.87,19.91 arc90 99.36,20.42 94.23,20.42 arc-90 93.07,21.59 93.07,39.83 arc90 91.08,41.81 84.23,41.81 arc-90 XIO.17
N$54
  Top 0.305: XIO.16 arc-90 85.5,45.72 89.92,45.72 arc-90 92.81,42.82 92.81,21.9 arc90 94.28,20.42 98.5,20.42 arc90 SV1.5
N$55
  Bottom 0.305: SV1.7 99.87,24.79 arc90 99.16,25.5 95,25.5 arc-90 93.73,26.77 93.73,43.59 arc90 92.96,44.35 84.23,44.35 arc-90 XIO.15
N$56
  Top 0.305: SV1.9 99.87,27.23 arc90 98.96,28.14 95.15,28.14 arc-90 93.52,29.77 93.52,46.63 arc90 91.95,48.21 XIO.14
N$57
  Bottom 0.305: SV1.11 arc90 98.65,30.63 | 96.98,30.73 arc-90 94.39,33.88 94.28,43.79 arc90 93.37,45.01 90.63,45.01 arc-90 89.76,45.87 arc90 88.65,46.99 84.12,46.99 arc-90 XIO.13
  Bottom 0.406: 96.98,30.73 98.65,30.63
N$58
  Top 0.305: SV1.13 99.87,32.11 arc90 98.76,33.22 95.2,33.22 arc-90 94.13,34.29 94.13,49.38 arc90 92.71,50.8 85.5,50.8 arc90 XIO.12
N$59
  Bottom 0.305: SV1.15 99.87,35.15 arc90 99.36,35.66 95.55,35.66 arc-90 95,36.22 95,44.55 arc90 93.57,45.97 92.61,45.97 arc-90 90.07,48.51 arc90 89.1,49.48 84.18,49.48 arc-90 XIO.11
N$60
  Top 0.305: SV1.14 97.33,31.85
  Top 0.406: XIO.3 80.62,60.91 80.21,60.5 80.21,37.9 80.98,37.14 80.98,37.08 81.23,36.83 81.23,19 81.58,18.64 88.9,18.64 arc-90 89.31,18.24 89.31,17.48 arc90 94.03,12.75 101.6,13.01 arc90 103.68,14.43 103.73,30.58 102.77,30.63 98.81,30.63 SV1.14
N$61
  Bottom 0.305: SV1.16 97.33,33.93 arc90 98.04,33.22 101.75,33.22
  Bottom 0.406: XIO.4 85.8,60.91 arc90 86.82,62.59 86.82,67.21 arc-90 87.78,67.51 103.78,67.51 arc-90 104.85,66.45 104.85,36.32 arc-90 101.75,33.22
N$62
  Top 0.305: SV1.18 97.79,37.03 arc90 98.6,37.85 98.6,57.66 arc90 97.69,58.57 89.92,58.57 arc-90 89.41,59.08 arc90 88.8,59.64 84.33,59.64 arc90 XIO.5
N$63
  Bottom 0.406: XIO.6 86,58.37 arc90 87.53,59.89 87.53,63.96 arc-90 88.7,65.13 90.68,65.13 arc90 92.25,66.7 102.77,66.7 arc-90 104.19,65.28 104.19,39.57 arc-90 103.23,38.3 98.6,38.3 arc-90 SV1.20
N$64
  Bottom 0.305: SV1.22 97.99,42.11 arc90 98.55,42.67 98.55,55.27 arc90 97.74,56.08 90.32,56.08 arc90 89.56,55.32 arc-90 88.8,54.56 84.18,54.56 arc-90 XIO.7
N$65
  Top 0.305: SV1.24 95.81,44.65 arc-90 94.89,45.57 94.89,54.56 arc90 93.62,55.83 XIO.8
N$66
  Bottom 0.305: SV1.26 92.35,47.19 arc-90 91.29,48.26 91.29,50.39 arc90 89.61,52.07 84.18,52.07 arc-90 83.92,52.32 83.92,52.98 arc90 83.67,53.24 82.96,53.24 arc-90 XIO.9
N$67
  Bottom 0.305: SV1.28 93.32,49.73 arc-90 92,51.05 92,52.58 arc90 91.29,53.29 XIO.10
N$68
  Top 0.305: SV1.30 96.22,52.27 arc-90 95.71,52.78 95.71,56.08 arc90 94.64,57.15 81.58,57.15 arc90 80.92,56.49 80.92,38.66 arc90 81.58,38 82.85,38 arc90 XIO.21
N$69
  Bottom 0.305: SV1.12 97.79,29.41 arc-90 98.45,28.75 98.45,28.65 arc90 99.01,28.09 100.69,28.09 arc-90 101.19,27.58 101.19,18.75 arc-90 100.43,17.98 97.94,17.98 arc-90 97.28,18.64 97.28,19.2 arc-90 SV1.4
N$70  (via drill 0.6)
  Top 0.305: v90.02,37.34 90.02,17.37 arc90 93.73,13.67 101.14,13.67 arc90 102.51,14.73 102.51,24.79 arc90 101.4,25.5 98.7,25.5 arc-90 SV1.10
  Bottom 0.305: XIO.20 89.46,40.59 arc-90 90.02,40.03 v90.02,37.34
N$71
  Top 0.305: XIO.19 82.91,40.54 arc90 84.12,39.32 90.47,39.32 arc-90 91.54,38.25 91.54,17.07 arc90 94.03,14.58 100.18,14.58 arc90 101.19,15.6 101.19,22.5 arc90 100.63,23.06 97.89,23.06 arc-90 97.33,23.62 SV1.8
N$72
  Bottom 0.305: SV1.34 arc-90 97.08,57.1 81.48,57.1 arc90 80.92,56.54 80.92,40.28 arc90 81.89,39.32 84.99,39.32 arc-90 85.39,38.91 85.39,38.1 arc90 XIO.22
N$73
  Bottom 0.406: R9.2 arc-90 88.95,62.43 SV1.38
N$74
  Bottom 0.406: C10.+ 78.23,2.39 arc-90 77.27,1.42 57.56,1.42 arc-90 55.17,3.81 55.17,5.89 arc-90 IC1.OUT 59.44,13.31 40.44,13.31 arc90 40.23,13.11 39.12,13.11 arc90 39.07,13.06 39.07,7.26 arc-90 JP9.2
N$75
  Bottom 0.406: POWER.4 POWER1.4 24.33,8.03 21.03,4.72 JP10.2
V+
  Bottom 0.813: POWER1.8 POWER.8

### Text on the board
tPlace: 9 | 8 | 7 | 6 | 5 | 4 | 3 | 2 | 1 | 0 | 22 | 14 | 15 | 16 | 17 | 18 | 19 | 20 | 21 | 13 | 12 | 11 | 10 | 24 | 26 | 28 | 30 | 31 | 32 | 33 | 34 | 35 | 36 | 37 | 38 | 39 | 40 | 41 | 42 | 43 | 44 | 45 | 46 | 47 | 48 | 49 | 50 | 51 | 52 | 53 | 8 | 9 | 10 | 11 | DAC0 | DAC1 | CANRX | CANTX
tNames: 5V | GND | SCL1 | SDA1 | AREF | GND
ReferenceLC: PC1